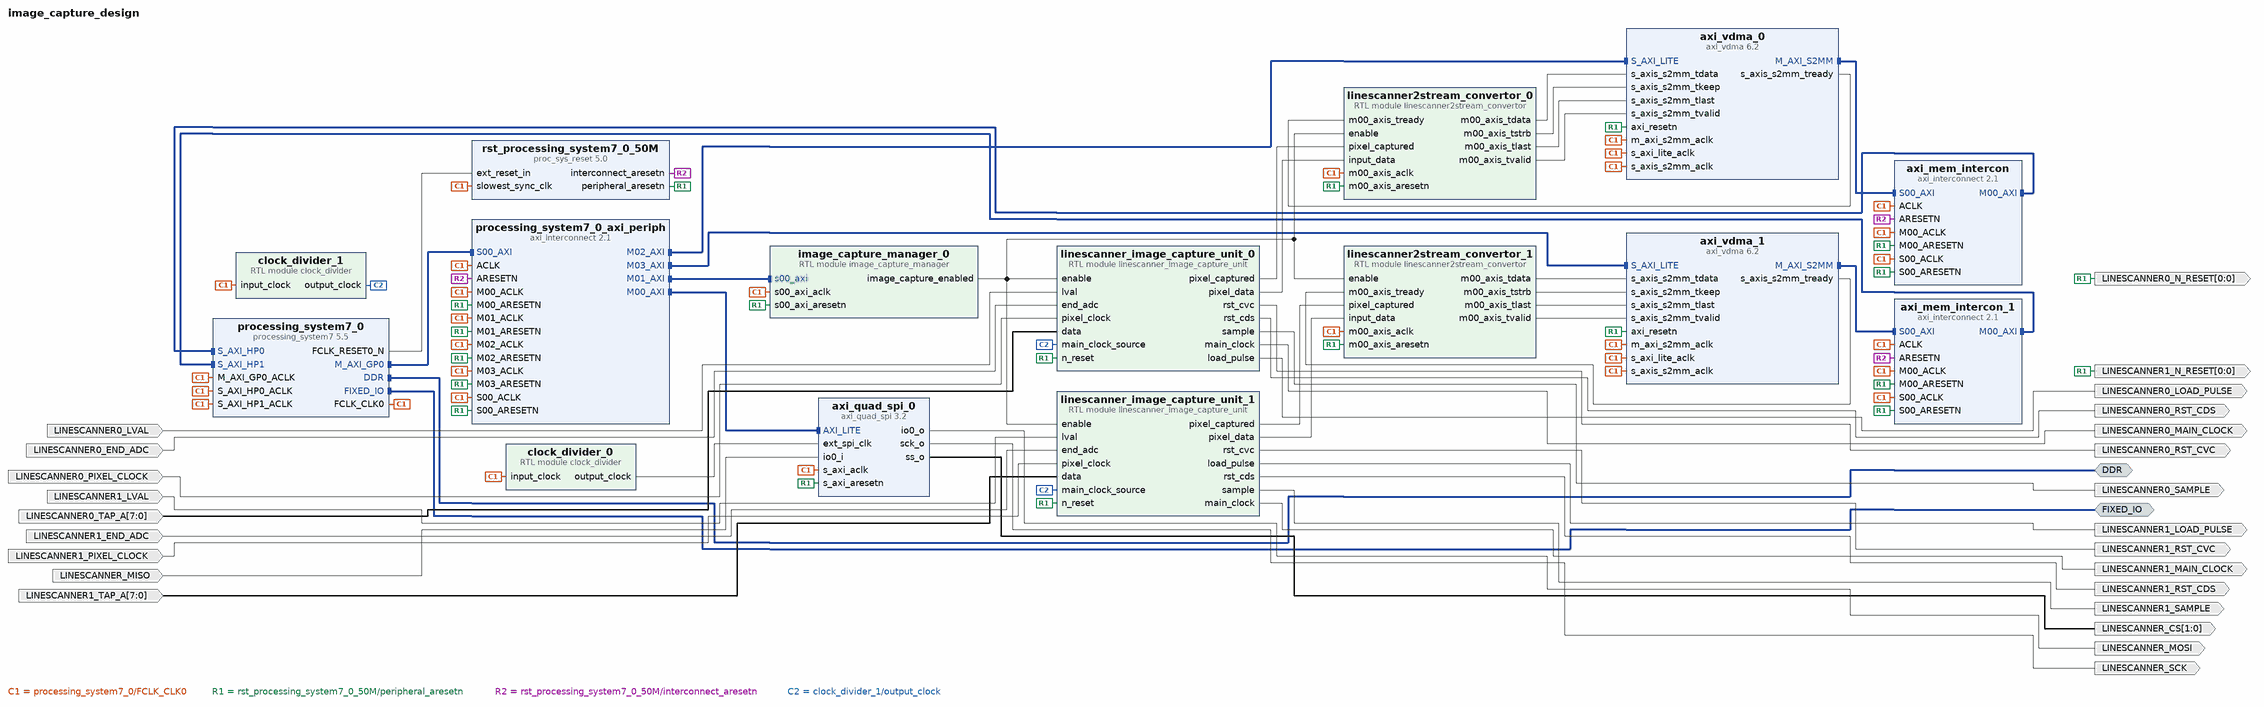
[diagram p0: block diagram of the top level]
# Vivado block design image_capture_design, Vivado 2016.2
create_bd_design image_capture_design

create_bd_intf_port -mode Master -vlnv xilinx.com:interface:ddrx_rtl:1.0 DDR
create_bd_intf_port -mode Master -vlnv xilinx.com:display_processing_system7:fixedio_rtl:1.0 FIXED_IO
create_bd_port -dir O -from 0 -to 0 LINESCANNER0_N_RESET
create_bd_port -dir O -from 0 -to 0 LINESCANNER1_N_RESET
create_bd_port -dir O LINESCANNER0_RST_CVC
create_bd_port -dir O LINESCANNER0_RST_CDS
create_bd_port -dir O LINESCANNER1_RST_CVC
create_bd_port -dir O LINESCANNER1_RST_CDS
create_bd_port -dir O LINESCANNER1_LOAD_PULSE
create_bd_port -dir O LINESCANNER0_SAMPLE
create_bd_port -dir O LINESCANNER1_SAMPLE
create_bd_port -dir O -type clk LINESCANNER0_MAIN_CLOCK
create_bd_port -dir O -type clk LINESCANNER1_MAIN_CLOCK
create_bd_port -dir I LINESCANNER0_LVAL
create_bd_port -dir I LINESCANNER1_LVAL
create_bd_port -dir I LINESCANNER1_END_ADC
create_bd_port -dir I LINESCANNER0_END_ADC
create_bd_port -dir O LINESCANNER0_LOAD_PULSE
create_bd_port -dir I -type clk LINESCANNER1_PIXEL_CLOCK
create_bd_port -dir I -type clk LINESCANNER0_PIXEL_CLOCK
set_property -dict {CONFIG.FREQ_HZ 50000000} [get_bd_ports LINESCANNER0_PIXEL_CLOCK]
create_bd_port -dir I -from 7 -to 0 LINESCANNER0_TAP_A
create_bd_port -dir I -from 7 -to 0 LINESCANNER1_TAP_A
create_bd_port -dir O LINESCANNER_MOSI
create_bd_port -dir O LINESCANNER_SCK
create_bd_port -dir O -from 1 -to 0 LINESCANNER_CS
create_bd_port -dir I LINESCANNER_MISO

create_bd_cell -type ip -vlnv xilinx.com:ip:axi_interconnect:2.1 axi_mem_intercon
set_property -dict {CONFIG.NUM_MI 1} [get_bd_cells axi_mem_intercon]
create_bd_cell -type ip -vlnv xilinx.com:ip:axi_interconnect:2.1 axi_mem_intercon_1
set_property -dict {CONFIG.NUM_MI 1} [get_bd_cells axi_mem_intercon_1]
create_bd_cell -type ip -vlnv xilinx.com:ip:axi_quad_spi:3.2 axi_quad_spi_0
set_property -dict [list \
  CONFIG.C_USE_STARTUP 0 \
  CONFIG.C_NUM_SS_BITS 2 \
  CONFIG.C_SCK_RATIO 16 \
  CONFIG.C_FIFO_DEPTH 16 \
  CONFIG.C_XIP_MODE 0 \
  CONFIG.C_TYPE_OF_AXI4_INTERFACE 0 \
  CONFIG.Master_mode 1 \
  CONFIG.FIFO_INCLUDED 1 \
] [get_bd_cells axi_quad_spi_0]
create_bd_cell -type ip -vlnv xilinx.com:ip:axi_vdma:6.2 axi_vdma_0
set_property -dict {CONFIG.c_include_mm2s 0} [get_bd_cells axi_vdma_0]
create_bd_cell -type ip -vlnv xilinx.com:ip:axi_vdma:6.2 axi_vdma_1
set_property -dict {CONFIG.c_include_mm2s 0} [get_bd_cells axi_vdma_1]
create_bd_cell -type ip -vlnv xilinx.com:ip:processing_system7:5.5 processing_system7_0
set_property -dict [list \
  CONFIG.PCW_FCLK_CLK0_BUF true \
  CONFIG.PCW_UIPARAM_DDR_FREQ_MHZ 533.333313 \
  CONFIG.PCW_CPU_CPU_6X4X_MAX_RANGE 867 \
  CONFIG.PCW_APU_PERIPHERAL_FREQMHZ 666.666667 \
  CONFIG.PCW_SDIO_PERIPHERAL_FREQMHZ 50 \
  CONFIG.PCW_UART_PERIPHERAL_FREQMHZ 50 \
  CONFIG.PCW_FPGA0_PERIPHERAL_FREQMHZ 100 \
  CONFIG.PCW_FPGA1_PERIPHERAL_FREQMHZ 200.000000 \
  CONFIG.PCW_USE_S_AXI_HP0 1 \
  CONFIG.PCW_USE_S_AXI_HP1 1 \
  CONFIG.PCW_M_AXI_GP0_FREQMHZ 50 \
  CONFIG.PCW_S_AXI_HP0_FREQMHZ 142 \
  CONFIG.PCW_USE_FABRIC_INTERRUPT 1 \
  CONFIG.PCW_GPIO_EMIO_GPIO_WIDTH 4 \
  CONFIG.PCW_PERIPHERAL_BOARD_PRESET part0 \
  CONFIG.PCW_PRESET_BANK1_VOLTAGE {LVCMOS 3.3V} \
  CONFIG.PCW_UIPARAM_DDR_BUS_WIDTH {16 Bit} \
  CONFIG.PCW_UIPARAM_DDR_PARTNO Custom \
  CONFIG.PCW_NAND_PERIPHERAL_ENABLE 1 \
  CONFIG.PCW_NAND_NAND_IO {MIO 0 2.. 14} \
  CONFIG.PCW_ENET0_PERIPHERAL_ENABLE 0 \
  CONFIG.PCW_SD0_PERIPHERAL_ENABLE 1 \
  CONFIG.PCW_SD0_SD0_IO {MIO 28 .. 33} \
  CONFIG.PCW_SD0_GRP_CD_ENABLE 1 \
  CONFIG.PCW_SD0_GRP_CD_IO {MIO 35} \
  CONFIG.PCW_SD0_GRP_WP_ENABLE 1 \
  CONFIG.PCW_SD0_GRP_WP_IO {MIO 34} \
  CONFIG.PCW_UART1_PERIPHERAL_ENABLE 1 \
  CONFIG.PCW_UART1_UART1_IO {MIO 48 .. 49} \
  CONFIG.PCW_TTC0_PERIPHERAL_ENABLE 1 \
  CONFIG.PCW_TTC0_TTC0_IO EMIO \
  CONFIG.PCW_USB0_PERIPHERAL_ENABLE 0 \
  CONFIG.PCW_USB_RESET_ENABLE 0 \
  CONFIG.PCW_I2C_RESET_ENABLE 0 \
  CONFIG.PCW_GPIO_MIO_GPIO_ENABLE 1 \
  CONFIG.PCW_GPIO_MIO_GPIO_IO MIO \
  CONFIG.PCW_GPIO_EMIO_GPIO_ENABLE 1 \
  CONFIG.PCW_GPIO_EMIO_GPIO_IO 4 \
  CONFIG.PCW_ENET1_PERIPHERAL_CLKSRC External \
] [get_bd_cells processing_system7_0]
# 512 more settings of processing_system7_0 are not shown: defaults, MIO pin electricals, DDR timing, and values the tool derives
create_bd_cell -type ip -vlnv xilinx.com:ip:axi_interconnect:2.1 processing_system7_0_axi_periph
set_property -dict {CONFIG.NUM_SI 1 CONFIG.NUM_MI 4} [get_bd_cells processing_system7_0_axi_periph]
create_bd_cell -type ip -vlnv xilinx.com:ip:proc_sys_reset:5.0 rst_processing_system7_0_50M
create_bd_cell -type module -reference linescanner2stream_convertor linescanner2stream_convertor_0
create_bd_cell -type module -reference clock_divider clock_divider_0
set_property -dict {CONFIG.clock_division 5} [get_bd_cells clock_divider_0]
create_bd_cell -type module -reference image_capture_manager image_capture_manager_0
create_bd_cell -type module -reference linescanner_image_capture_unit linescanner_image_capture_unit_0
create_bd_cell -type module -reference linescanner2stream_convertor linescanner2stream_convertor_1
create_bd_cell -type module -reference clock_divider clock_divider_1
create_bd_cell -type module -reference linescanner_image_capture_unit linescanner_image_capture_unit_1

# ---- connections ----

connect_bd_intf_net [get_bd_intf_pins processing_system7_0/M_AXI_GP0] [get_bd_intf_pins processing_system7_0_axi_periph/S00_AXI]
connect_bd_intf_net [get_bd_intf_pins processing_system7_0_axi_periph/M00_AXI] [get_bd_intf_pins axi_quad_spi_0/AXI_LITE]
connect_bd_intf_net [get_bd_intf_pins image_capture_manager_0/s00_axi] [get_bd_intf_pins processing_system7_0_axi_periph/M01_AXI]
connect_bd_intf_net [get_bd_intf_pins processing_system7_0_axi_periph/M02_AXI] [get_bd_intf_pins axi_vdma_0/S_AXI_LITE]
connect_bd_intf_net [get_bd_intf_pins processing_system7_0_axi_periph/M03_AXI] [get_bd_intf_pins axi_vdma_1/S_AXI_LITE]
connect_bd_intf_net [get_bd_intf_pins axi_vdma_0/M_AXI_S2MM] [get_bd_intf_pins axi_mem_intercon/S00_AXI]
connect_bd_intf_net [get_bd_intf_pins axi_mem_intercon/M00_AXI] [get_bd_intf_pins processing_system7_0/S_AXI_HP0]
connect_bd_intf_net [get_bd_intf_pins axi_vdma_1/M_AXI_S2MM] [get_bd_intf_pins axi_mem_intercon_1/S00_AXI]
connect_bd_intf_net [get_bd_intf_pins axi_mem_intercon_1/M00_AXI] [get_bd_intf_pins processing_system7_0/S_AXI_HP1]
connect_bd_intf_net [get_bd_intf_ports DDR] [get_bd_intf_pins processing_system7_0/DDR]
connect_bd_intf_net [get_bd_intf_ports FIXED_IO] [get_bd_intf_pins processing_system7_0/FIXED_IO]
connect_bd_net [get_bd_pins processing_system7_0/FCLK_CLK0] \
  [get_bd_pins axi_quad_spi_0/s_axi_aclk] [get_bd_pins axi_vdma_0/s_axi_lite_aclk] [get_bd_pins axi_vdma_0/m_axi_s2mm_aclk] \
  [get_bd_pins axi_vdma_0/s_axis_s2mm_aclk] [get_bd_pins axi_vdma_1/s_axi_lite_aclk] [get_bd_pins axi_vdma_1/m_axi_s2mm_aclk] \
  [get_bd_pins axi_vdma_1/s_axis_s2mm_aclk] [get_bd_pins processing_system7_0/M_AXI_GP0_ACLK] \
  [get_bd_pins processing_system7_0/S_AXI_HP0_ACLK] [get_bd_pins rst_processing_system7_0_50M/slowest_sync_clk] \
  [get_bd_pins linescanner2stream_convertor_0/m00_axis_aclk] [get_bd_pins clock_divider_0/input_clock] \
  [get_bd_pins image_capture_manager_0/s00_axi_aclk] [get_bd_pins processing_system7_0/S_AXI_HP1_ACLK] \
  [get_bd_pins axi_mem_intercon/ACLK] [get_bd_pins axi_mem_intercon/S00_ACLK] [get_bd_pins axi_mem_intercon/M00_ACLK] \
  [get_bd_pins axi_mem_intercon_1/ACLK] [get_bd_pins axi_mem_intercon_1/S00_ACLK] [get_bd_pins axi_mem_intercon_1/M00_ACLK] \
  [get_bd_pins processing_system7_0_axi_periph/ACLK] [get_bd_pins processing_system7_0_axi_periph/S00_ACLK] \
  [get_bd_pins processing_system7_0_axi_periph/M00_ACLK] [get_bd_pins processing_system7_0_axi_periph/M01_ACLK] \
  [get_bd_pins processing_system7_0_axi_periph/M02_ACLK] [get_bd_pins processing_system7_0_axi_periph/M03_ACLK] \
  [get_bd_pins linescanner2stream_convertor_1/m00_axis_aclk] [get_bd_pins clock_divider_1/input_clock]
connect_bd_net [get_bd_pins processing_system7_0/FCLK_RESET0_N] [get_bd_pins rst_processing_system7_0_50M/ext_reset_in]
connect_bd_net [get_bd_pins rst_processing_system7_0_50M/peripheral_aresetn] \
  [get_bd_ports LINESCANNER1_N_RESET] [get_bd_ports LINESCANNER0_N_RESET] [get_bd_pins axi_quad_spi_0/s_axi_aresetn] \
  [get_bd_pins axi_vdma_0/axi_resetn] [get_bd_pins axi_vdma_1/axi_resetn] \
  [get_bd_pins linescanner2stream_convertor_0/m00_axis_aresetn] [get_bd_pins image_capture_manager_0/s00_axi_aresetn] \
  [get_bd_pins linescanner_image_capture_unit_0/n_reset] [get_bd_pins axi_mem_intercon/S00_ARESETN] \
  [get_bd_pins axi_mem_intercon/M00_ARESETN] [get_bd_pins axi_mem_intercon_1/S00_ARESETN] \
  [get_bd_pins axi_mem_intercon_1/M00_ARESETN] [get_bd_pins processing_system7_0_axi_periph/S00_ARESETN] \
  [get_bd_pins processing_system7_0_axi_periph/M00_ARESETN] [get_bd_pins processing_system7_0_axi_periph/M01_ARESETN] \
  [get_bd_pins processing_system7_0_axi_periph/M02_ARESETN] [get_bd_pins processing_system7_0_axi_periph/M03_ARESETN] \
  [get_bd_pins linescanner2stream_convertor_1/m00_axis_aresetn] [get_bd_pins linescanner_image_capture_unit_1/n_reset]
connect_bd_net [get_bd_pins rst_processing_system7_0_50M/interconnect_aresetn] \
  [get_bd_pins axi_mem_intercon/ARESETN] [get_bd_pins axi_mem_intercon_1/ARESETN] \
  [get_bd_pins processing_system7_0_axi_periph/ARESETN]
connect_bd_net -net linescanner2stream_convertor_0_stream_data [get_bd_pins linescanner2stream_convertor_0/m00_axis_tdata] \
  [get_bd_pins axi_vdma_0/s_axis_s2mm_tdata]
connect_bd_net -net linescanner2stream_convertor_0_keep_data [get_bd_pins linescanner2stream_convertor_0/m00_axis_tstrb] \
  [get_bd_pins axi_vdma_0/s_axis_s2mm_tkeep]
connect_bd_net -net linescanner2stream_convertor_0_last_data [get_bd_pins linescanner2stream_convertor_0/m00_axis_tlast] \
  [get_bd_pins axi_vdma_0/s_axis_s2mm_tlast]
connect_bd_net [get_bd_pins axi_vdma_0/s_axis_s2mm_tready] [get_bd_pins linescanner2stream_convertor_0/m00_axis_tready]
connect_bd_net -net linescanner2stream_convertor_0_stream_data_valid [get_bd_pins linescanner2stream_convertor_0/m00_axis_tvalid] \
  [get_bd_pins axi_vdma_0/s_axis_s2mm_tvalid]
connect_bd_net -net linescanner2stream_convertor_1_stream_data [get_bd_pins linescanner2stream_convertor_1/m00_axis_tdata] \
  [get_bd_pins axi_vdma_1/s_axis_s2mm_tdata]
connect_bd_net -net linescanner2stream_convertor_1_keep_data [get_bd_pins linescanner2stream_convertor_1/m00_axis_tstrb] \
  [get_bd_pins axi_vdma_1/s_axis_s2mm_tkeep]
connect_bd_net -net linescanner2stream_convertor_1_last_data [get_bd_pins linescanner2stream_convertor_1/m00_axis_tlast] \
  [get_bd_pins axi_vdma_1/s_axis_s2mm_tlast]
connect_bd_net -net linescanner2stream_convertor_1_stream_data_valid [get_bd_pins linescanner2stream_convertor_1/m00_axis_tvalid] \
  [get_bd_pins axi_vdma_1/s_axis_s2mm_tvalid]
connect_bd_net [get_bd_pins axi_vdma_1/s_axis_s2mm_tready] [get_bd_pins linescanner2stream_convertor_1/m00_axis_tready]
connect_bd_net -net image_capture_manager_v1_0_0_image_capture_enabled [get_bd_pins image_capture_manager_0/image_capture_enabled] \
  [get_bd_pins linescanner2stream_convertor_0/enable] [get_bd_pins linescanner_image_capture_unit_0/enable] \
  [get_bd_pins linescanner2stream_convertor_1/enable] [get_bd_pins linescanner_image_capture_unit_1/enable]
connect_bd_net [get_bd_pins clock_divider_0/output_clock] [get_bd_pins axi_quad_spi_0/ext_spi_clk]
connect_bd_net [get_bd_pins linescanner_image_capture_unit_0/rst_cvc] [get_bd_ports LINESCANNER0_RST_CVC]
connect_bd_net [get_bd_pins linescanner_image_capture_unit_0/rst_cds] [get_bd_ports LINESCANNER0_RST_CDS]
connect_bd_net [get_bd_pins linescanner_image_capture_unit_1/rst_cvc] [get_bd_ports LINESCANNER1_RST_CVC]
connect_bd_net [get_bd_pins linescanner_image_capture_unit_1/rst_cds] [get_bd_ports LINESCANNER1_RST_CDS]
connect_bd_net [get_bd_pins linescanner_image_capture_unit_1/load_pulse] [get_bd_ports LINESCANNER1_LOAD_PULSE]
connect_bd_net [get_bd_pins linescanner_image_capture_unit_0/sample] [get_bd_ports LINESCANNER0_SAMPLE]
connect_bd_net [get_bd_pins linescanner_image_capture_unit_1/sample] [get_bd_ports LINESCANNER1_SAMPLE]
connect_bd_net [get_bd_pins linescanner_image_capture_unit_0/main_clock] [get_bd_ports LINESCANNER0_MAIN_CLOCK]
connect_bd_net [get_bd_pins linescanner_image_capture_unit_1/main_clock] [get_bd_ports LINESCANNER1_MAIN_CLOCK]
connect_bd_net [get_bd_pins linescanner_image_capture_unit_1/pixel_captured] [get_bd_pins linescanner2stream_convertor_1/pixel_captured]
connect_bd_net [get_bd_pins linescanner_image_capture_unit_1/pixel_data] [get_bd_pins linescanner2stream_convertor_1/input_data]
connect_bd_net [get_bd_pins linescanner_image_capture_unit_0/pixel_captured] [get_bd_pins linescanner2stream_convertor_0/pixel_captured]
connect_bd_net [get_bd_pins linescanner_image_capture_unit_0/pixel_data] [get_bd_pins linescanner2stream_convertor_0/input_data]
connect_bd_net [get_bd_ports LINESCANNER0_LVAL] [get_bd_pins linescanner_image_capture_unit_0/lval]
connect_bd_net [get_bd_ports LINESCANNER1_LVAL] [get_bd_pins linescanner_image_capture_unit_1/lval]
connect_bd_net [get_bd_ports LINESCANNER1_END_ADC] [get_bd_pins linescanner_image_capture_unit_1/end_adc]
connect_bd_net [get_bd_ports LINESCANNER0_END_ADC] [get_bd_pins linescanner_image_capture_unit_0/end_adc]
connect_bd_net [get_bd_pins clock_divider_1/output_clock] \
  [get_bd_pins linescanner_image_capture_unit_0/main_clock_source] \
  [get_bd_pins linescanner_image_capture_unit_1/main_clock_source]
connect_bd_net [get_bd_pins linescanner_image_capture_unit_0/load_pulse] [get_bd_ports LINESCANNER0_LOAD_PULSE]
connect_bd_net [get_bd_ports LINESCANNER1_PIXEL_CLOCK] [get_bd_pins linescanner_image_capture_unit_1/pixel_clock]
connect_bd_net [get_bd_ports LINESCANNER0_PIXEL_CLOCK] [get_bd_pins linescanner_image_capture_unit_0/pixel_clock]
connect_bd_net [get_bd_ports LINESCANNER0_TAP_A] [get_bd_pins linescanner_image_capture_unit_0/data]
connect_bd_net [get_bd_ports LINESCANNER1_TAP_A] [get_bd_pins linescanner_image_capture_unit_1/data]
connect_bd_net [get_bd_pins axi_quad_spi_0/io0_o] [get_bd_ports LINESCANNER_MOSI]
connect_bd_net [get_bd_pins axi_quad_spi_0/sck_o] [get_bd_ports LINESCANNER_SCK]
connect_bd_net [get_bd_pins axi_quad_spi_0/ss_o] [get_bd_ports LINESCANNER_CS]
connect_bd_net [get_bd_ports LINESCANNER_MISO] [get_bd_pins axi_quad_spi_0/io0_i]

# ---- address map ----
assign_bd_address -offset 0x00000000 -range 16M -target_address_space [get_bd_addr_spaces axi_vdma_0/Data_S2MM] [get_bd_addr_segs processing_system7_0/S_AXI_HP0/HP0_DDR_LOWOCM]
assign_bd_address -offset 0x01000000 -range 16M -target_address_space [get_bd_addr_spaces axi_vdma_1/Data_S2MM] [get_bd_addr_segs processing_system7_0/S_AXI_HP1/HP1_DDR_LOWOCM]
assign_bd_address -offset 0x41E00000 -range 4K -target_address_space [get_bd_addr_spaces processing_system7_0/Data] [get_bd_addr_segs axi_quad_spi_0/AXI_LITE/Reg]
assign_bd_address -offset 0x43000000 -range 64K -target_address_space [get_bd_addr_spaces processing_system7_0/Data] [get_bd_addr_segs axi_vdma_0/S_AXI_LITE/Reg]
assign_bd_address -offset 0x43010000 -range 64K -target_address_space [get_bd_addr_spaces processing_system7_0/Data] [get_bd_addr_segs axi_vdma_1/S_AXI_LITE/Reg]
assign_bd_address -offset 0x43C00000 -range 4K -target_address_space [get_bd_addr_spaces processing_system7_0/Data] [get_bd_addr_segs image_capture_manager_0/s00_axi/reg0]

validate_bd_design
save_bd_design
